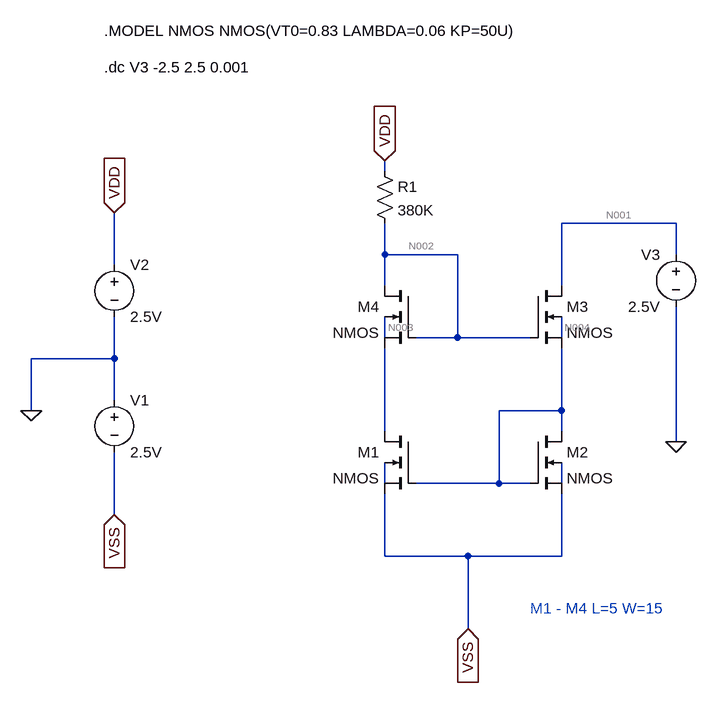
[diagram p0: schematic BalancedWilsonCM.asc]
BalancedWilsonCM.asc, the LTspice schematic file:
Version 4
SHEET 1 1412 688
WIRE 224 -128 224 -144
WIRE 672 -48 496 -48
WIRE 224 0 224 -48
WIRE 336 0 224 0
WIRE 672 0 672 -48
WIRE -192 16 -192 -64
WIRE 224 48 224 0
WIRE 496 48 496 -48
WIRE 224 128 224 96
WIRE 336 128 336 0
WIRE 336 128 272 128
WIRE 448 128 336 128
WIRE 496 128 496 96
WIRE -192 160 -192 96
WIRE -192 160 -320 160
WIRE -192 224 -192 160
WIRE -320 240 -320 160
WIRE 496 240 496 144
WIRE 496 240 400 240
WIRE 224 272 224 144
WIRE 496 272 496 240
WIRE 672 288 672 80
WIRE 224 352 224 320
WIRE 400 352 400 240
WIRE 400 352 272 352
WIRE 448 352 400 352
WIRE 496 352 496 320
WIRE -192 400 -192 304
WIRE 224 464 224 368
WIRE 352 464 224 464
WIRE 496 464 496 368
WIRE 496 464 352 464
WIRE 352 576 352 464
FLAG -320 240 0
FLAG 672 288 0
FLAG 224 -144 VDD
IOPIN 224 -144 In
FLAG -192 -64 VDD
IOPIN -192 -64 In
FLAG -192 400 VSS
IOPIN -192 400 In
FLAG 352 576 VSS
IOPIN 352 576 In
SYMBOL nmos4 272 272 M0
SYMATTR InstName M1
SYMATTR Value2 l=5 w=15
SYMBOL nmos4 448 272 R0
SYMATTR InstName M2
SYMATTR Value2 l=5 w=15
SYMBOL voltage -192 208 R0
WINDOW 123 0 0 Left 2
WINDOW 39 0 0 Left 2
SYMATTR InstName V1
SYMATTR Value 2.5V
SYMBOL voltage -192 0 R0
WINDOW 123 0 0 Left 2
WINDOW 39 0 0 Left 2
SYMATTR InstName V2
SYMATTR Value 2.5V
SYMBOL voltage 672 -16 M0
WINDOW 123 0 0 Left 2
WINDOW 39 0 0 Left 2
SYMATTR InstName V3
SYMATTR Value 2.5V
SYMBOL nmos4 448 48 R0
SYMATTR InstName M3
SYMATTR Value2 l=5 w=15
SYMBOL res 208 -144 R0
SYMATTR InstName R1
SYMATTR Value 380K
SYMBOL nmos4 272 48 M0
SYMATTR InstName M4
SYMATTR Value2 l=5 w=15
TEXT -208 -344 Left 2 !.MODEL NMOS NMOS(VT0=0.83 LAMBDA=0.06 KP=50U)
TEXT -208 -288 Left 2 !.dc V3 -2.5 2.5 0.001
TEXT 448 544 Left 2 ;M1 - M4 L=5 W=15

The netlist it stands for:
* BalancedWilsonCM.asc
M1 N006 N005 VSS N007 NMOS l=5 w=15
M2 N005 N005 VSS N008 NMOS l=5 w=15
V1 0 VSS 2.5V
V2 VDD 0 2.5V
V3 N001 0 2.5V
M3 N001 N002 N005 N004 NMOS l=5 w=15
R1 VDD N002 380K
M4 N002 N002 N006 N003 NMOS l=5 w=15
.model NMOS NMOS
.model PMOS PMOS
.lib standard.mos
.MODEL NMOS NMOS(VT0=0.83 LAMBDA=0.06 KP=50U)
.dc V3 -2.5 2.5 0.001
* M1 - M4 L=5 W=15
.backanno
.end

* Results of the author's LTspice run, read from the files saved beside the schematic
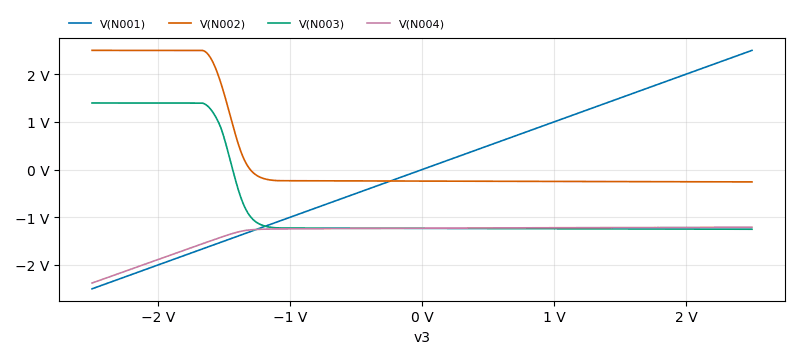
[diagram p1: DC transfer characteristic of BalancedWilsonCM.asc, plotted from the saved traces]
* DC transfer characteristic, 1 run:
*   V(N001): -2.5 V at v3=-2.5 V, 2.5 V at v3=2.5 V, min -2.5 V, max 2.5 V
*   V(N002): 2.5 V at v3=-2.5 V, -258.3 mV at v3=2.5 V, min -258.3 mV, max 2.5 V
*   V(N003): 1.397 V at v3=-2.5 V, -1.251 V at v3=2.5 V, min -1.251 V, max 1.397 V
*   V(N004): -2.379 V at v3=-2.5 V, -1.209 V at v3=2.5 V, min -2.379 V, max -1.209 V